# EAGLE schematic key (EAGLE 7.7.0)
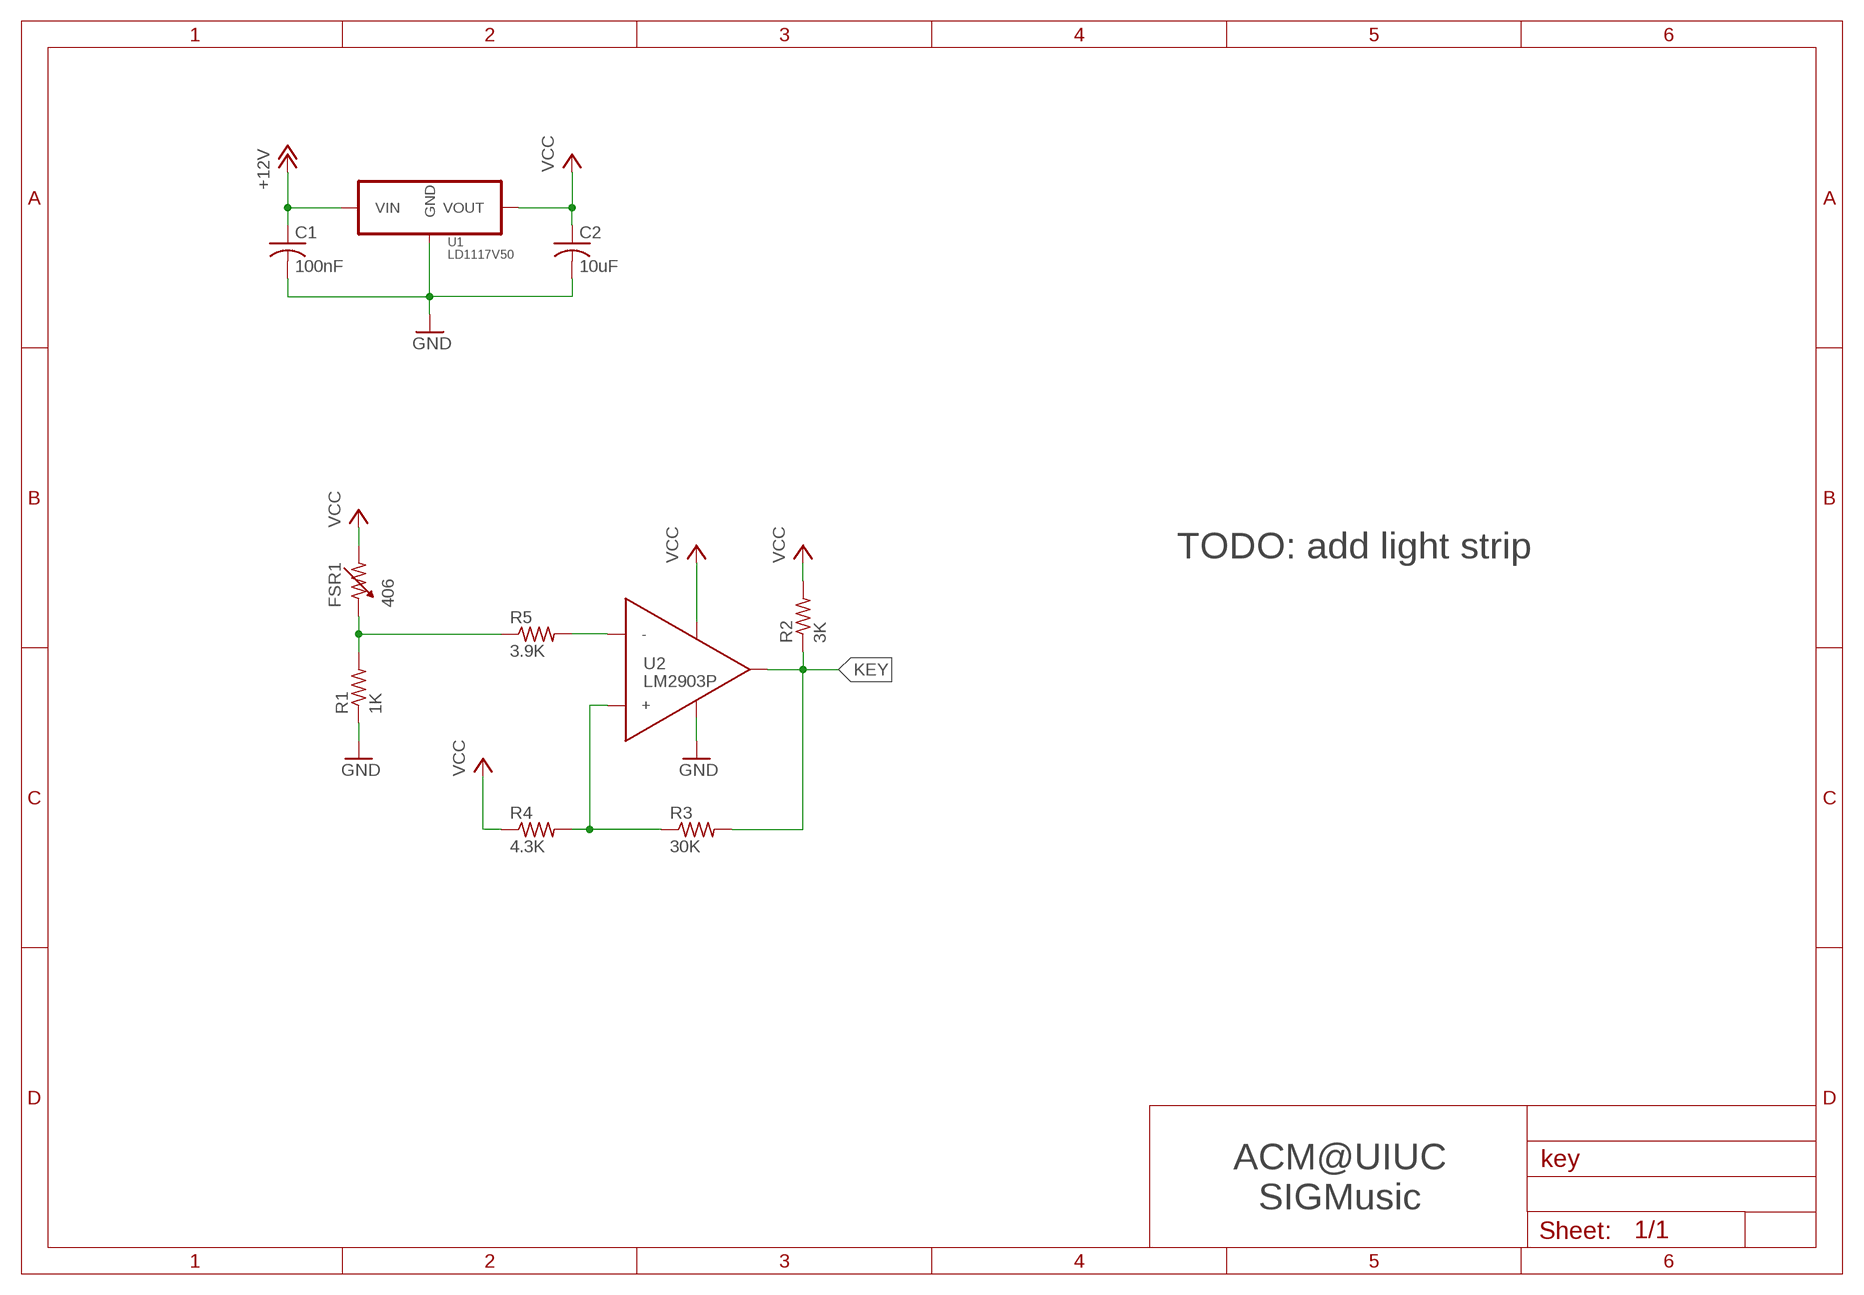
[diagram p0: schematic, sheet 1]

## Parts
C1  100nF  C-US025-025X050  [C025-025X050]
C2  10uF  C-US025-025X050  [C025-025X050]
FSR1  406  FSR-SQUARE  [FSR-SQUARE]
R1  1K  R-US_0207/10  [0207/10]
R2  3K  R-US_0207/10  [0207/10]
R3  30K  R-US_0207/10  [0207/10]
R4  4.3K  R-US_0207/10  [0207/10]
R5  3.9K  R-US_0207/10  [0207/10]
U1  LD1117V50  LD1117  [TO-220]
U2  LM2903P  [DIL08]

## Nets
+12V: C1.1 U1.P$3(VIN)
FORCE: FSR1.P$1 R1.2 R5.1
GND: C1.2 C2.2 R1.1 U2.4(GND) U2.5(GND) U2.6(GND) U2.7(GND)
KEY: R2.1 R3.2 U2.1
N$3: R3.1 R4.2 U2.3(+)
N$4: R5.2 U2.2(-)
VCC: C2.1 FSR1.P$2 R2.2 R4.1 U1.P$2(VOUT) U1.P$4(VOUT) U2.8(VCC)

## Notes on the sheet
- TODO: add light strip
- ACM@UIUC
  SIGMusic

## Power pins joined to a net without a drawn wire
GND: U1.P$1(GND)

## Library data of the parts
C1 C2 = rcl:C-US: CAPACITOR, American symbol
FSR1 = my-custom:FSR-SQUARE
R1-R5 = rcl:R-US_: RESISTOR, American symbol
U1 = my-custom:LD1117
U2 = my-custom:LM2903P